# Altium schematic sheet Juricic_Izlaz.SchDoc
size A
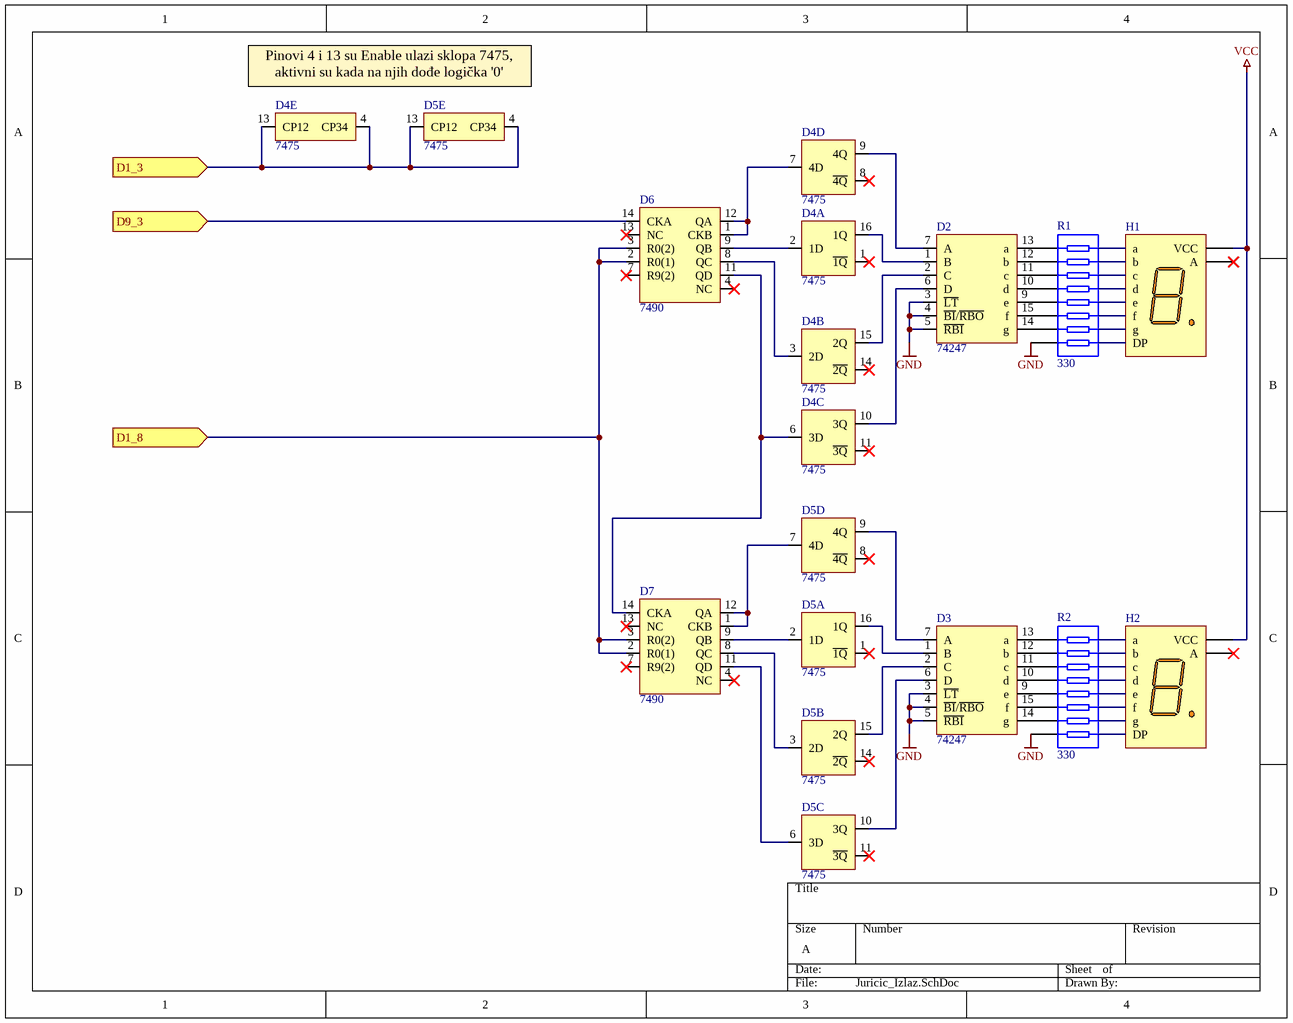
[diagram p0: Juricic_Izlaz.SchDoc]

## Parts
(Parts that share a designator on the sheet are numbered #1, #2 ... from top to bottom, then left to right.)
D2  74247  [DIP-16]
D3  74247  [DIP-16]
D4#1  7475  [DIP-16]  (part E of 5)
D4#2  7475  [DIP-16]  (parts A,B,C,D of 4)
D5#1  7475  [DIP-16]  (part E of 5)
D5#2  7475  [DIP-16]  (parts A,B,C,D of 4)
D6  7490  [DIP-14]
D7  7490  [DIP-14]
H1  Dpy Amber-CA  [A]  (value not drawn)
H2  Dpy Amber-CA  [A]  (value not drawn)
R1  330  [SSOP16_N]
R2  330  [SSOP16_N]

## Ports
D1_3 (in), D1_8 (in), D9_3 (in)

## Nets
GND: D2.3(~{LT}) D2.4(~{BI}/~{RBO}) D2.5(~{RBI}) D3.3(~{LT}) D3.4(~{BI}/~{RBO}) D3.5(~{RBI}) R1.8 R2.8
VCC: H1.1(VCC) H2.1(VCC)
D1_3: D4#1.4(CP34) D4#1.13(CP12) D5#1.4(CP34) D5#1.13(CP12) ; port D1_3
D1_8: D6.2(R0(1)) D6.3(R0(2)) D7.2(R0(1)) D7.3(R0(2)) ; port D1_8
D9_3: D6.14(CKA) ; port D9_3
NetD2_1: D2.1(B) D4#2.16(1Q)
NetD2_2: D2.2(C) D4#2.15(2Q)
NetD2_6: D2.6(D) D4#2.10(3Q)
NetD2_7: D2.7(A) D4#2.9(4Q)
NetD2_9: D2.9(e) R1.5
NetD2_10: D2.10(d) R1.4
NetD2_11: D2.11(c) R1.3
NetD2_12: D2.12(b) R1.2
NetD2_13: D2.13(a) R1.1
NetD2_14: D2.14(g) R1.7
NetD2_15: D2.15(f) R1.6
NetD3_1: D3.1(B) D5#2.16(1Q)
NetD3_2: D3.2(C) D5#2.15(2Q)
NetD3_6: D3.6(D) D5#2.10(3Q)
NetD3_7: D3.7(A) D5#2.9(4Q)
NetD3_9: D3.9(e) R2.5
NetD3_10: D3.10(d) R2.4
NetD3_11: D3.11(c) R2.3
NetD3_12: D3.12(b) R2.2
NetD3_13: D3.13(a) R2.1
NetD3_14: D3.14(g) R2.7
NetD3_15: D3.15(f) R2.6
NetD4#2_2: D4#2.2(1D) D6.9(QB)
NetD4#2_3: D4#2.3(2D) D6.8(QC)
NetD4#2_6: D4#2.6(3D) D6.11(QD) D7.14(CKA)
NetD4#2_7: D4#2.7(4D) D6.1(CKB) D6.12(QA)
NetD5#2_2: D5#2.2(1D) D7.9(QB)
NetD5#2_3: D5#2.3(2D) D7.8(QC)
NetD5#2_6: D5#2.6(3D) D7.11(QD)
NetD5#2_7: D5#2.7(4D) D7.1(CKB) D7.12(QA)
NetH1_2: H1.2(f) R1.11
NetH1_3: H1.3(g) R1.10
NetH1_4: H1.4(e) R1.12
NetH1_5: H1.5(d) R1.13
NetH1_7: H1.7(DP) R1.9
NetH1_8: H1.8(c) R1.14
NetH1_9: H1.9(b) R1.15
NetH1_10: H1.10(a) R1.16
NetH2_2: H2.2(f) R2.11
NetH2_3: H2.3(g) R2.10
NetH2_4: H2.4(e) R2.12
NetH2_5: H2.5(d) R2.13
NetH2_7: H2.7(DP) R2.9
NetH2_8: H2.8(c) R2.14
NetH2_9: H2.9(b) R2.15
NetH2_10: H2.10(a) R2.16

Not connected (* = marked no-connect by the designer): D4#2 1(~{1Q})* 8(~{4Q})* 11(~{3Q})* 14(~{2Q})*; D5#2 1(~{1Q})* 8(~{4Q})* 11(~{3Q})* 14(~{2Q})*; D6 4(NC)* 7(R9(2))* 13(NC)*; D7 4(NC)* 7(R9(2))* 13(NC)*; H1 6(A)*; H2 6(A)*

## Notes on the sheet
- Pinovi 4 i 13 su Enable ulazi sklopa 7475, aktivni su kada na njih dođe logička '0'

## Library data of the parts
D2 D3 = 74247: Dekoder BCD-a u 7-segmentni sklop; Cijena: 1.41; Kat. broj: 3119930; Dobavljač: Farnell; Tip: *
D4#1 D4#2 D5#1 D5#2 = 7475: 2-bitni CMOS bistabil; Cijena: 0.691; Kat. broj: CD74HC75E; Dobavljač: Farnell
D6 D7 = 7490: Dekadsko/binarno brojilo; Cijena: 1.33; Kat. broj: 1470790; Dobavljač: Farnell
H1 H2 = Dpy Amber-CA: 7.62 mm Black Surface Orange 7-Segment Display: CA, RH DP; MinimumIntensity: 354 ucd; Note: IF = 5 mA; Note: Pins 1 and 6 are redundant Anodes.; Published: 8-Jun-2000; LatestRevisionDate: 17-Dec-2003; LatestRevisionNote: Schematic revised, PCB Footprint replaced.; DatasheetVersion: 19-Feb-2002; PackageVersion: 11-Feb-2002; PackageReference: A; Publisher: Altium Limited; PackageDescription: LED, 7-Segment Display, 7.62 mm, RHD; 10 Leads; Row Space 5.08 mm; Pitch 2.54 mm; Colour: Orange; ComponentLink1Description: Manufacturer Link; ComponentLink1URL: http://www.agilent.com/
R1 = Res Pack4: 330 ohm, 8 resistor network; Cijena: 0.594; Kat. broj: 9356665; Dobavljač: Farnell; Published: 24-Mar-1999; LatestRevisionDate: 29-May-2009; LatestRevisionNote: IPC-7351 Footprint Added.; PackageVersion: Oct-2003; PackageReference: SSOP16; Publisher: Altium Limited; PackageDescription: 16-Pin Plastic Small Outline Package 0.65 mm Pitch; Code_JEDEC: MO-150-AC; Code_IPC: SOP65P780-16
R2 = Res Pack4: 330 ohm, 8 resistor network; Kat. broj: 9356665; Cijena: 0.594; Dobavljač: Farnell; Published: 24-Mar-1999; LatestRevisionDate: 29-May-2009; LatestRevisionNote: IPC-7351 Footprint Added.; PackageVersion: Oct-2003; PackageReference: SSOP16; Publisher: Altium Limited; PackageDescription: 16-Pin Plastic Small Outline Package 0.65 mm Pitch; Code_JEDEC: MO-150-AC; Code_IPC: SOP65P780-16